# Altium schematic sheet Ethernet_Sheet.SchDoc
size 420 x 297 mm; SheetNumber: 10; SheetTotal: 11
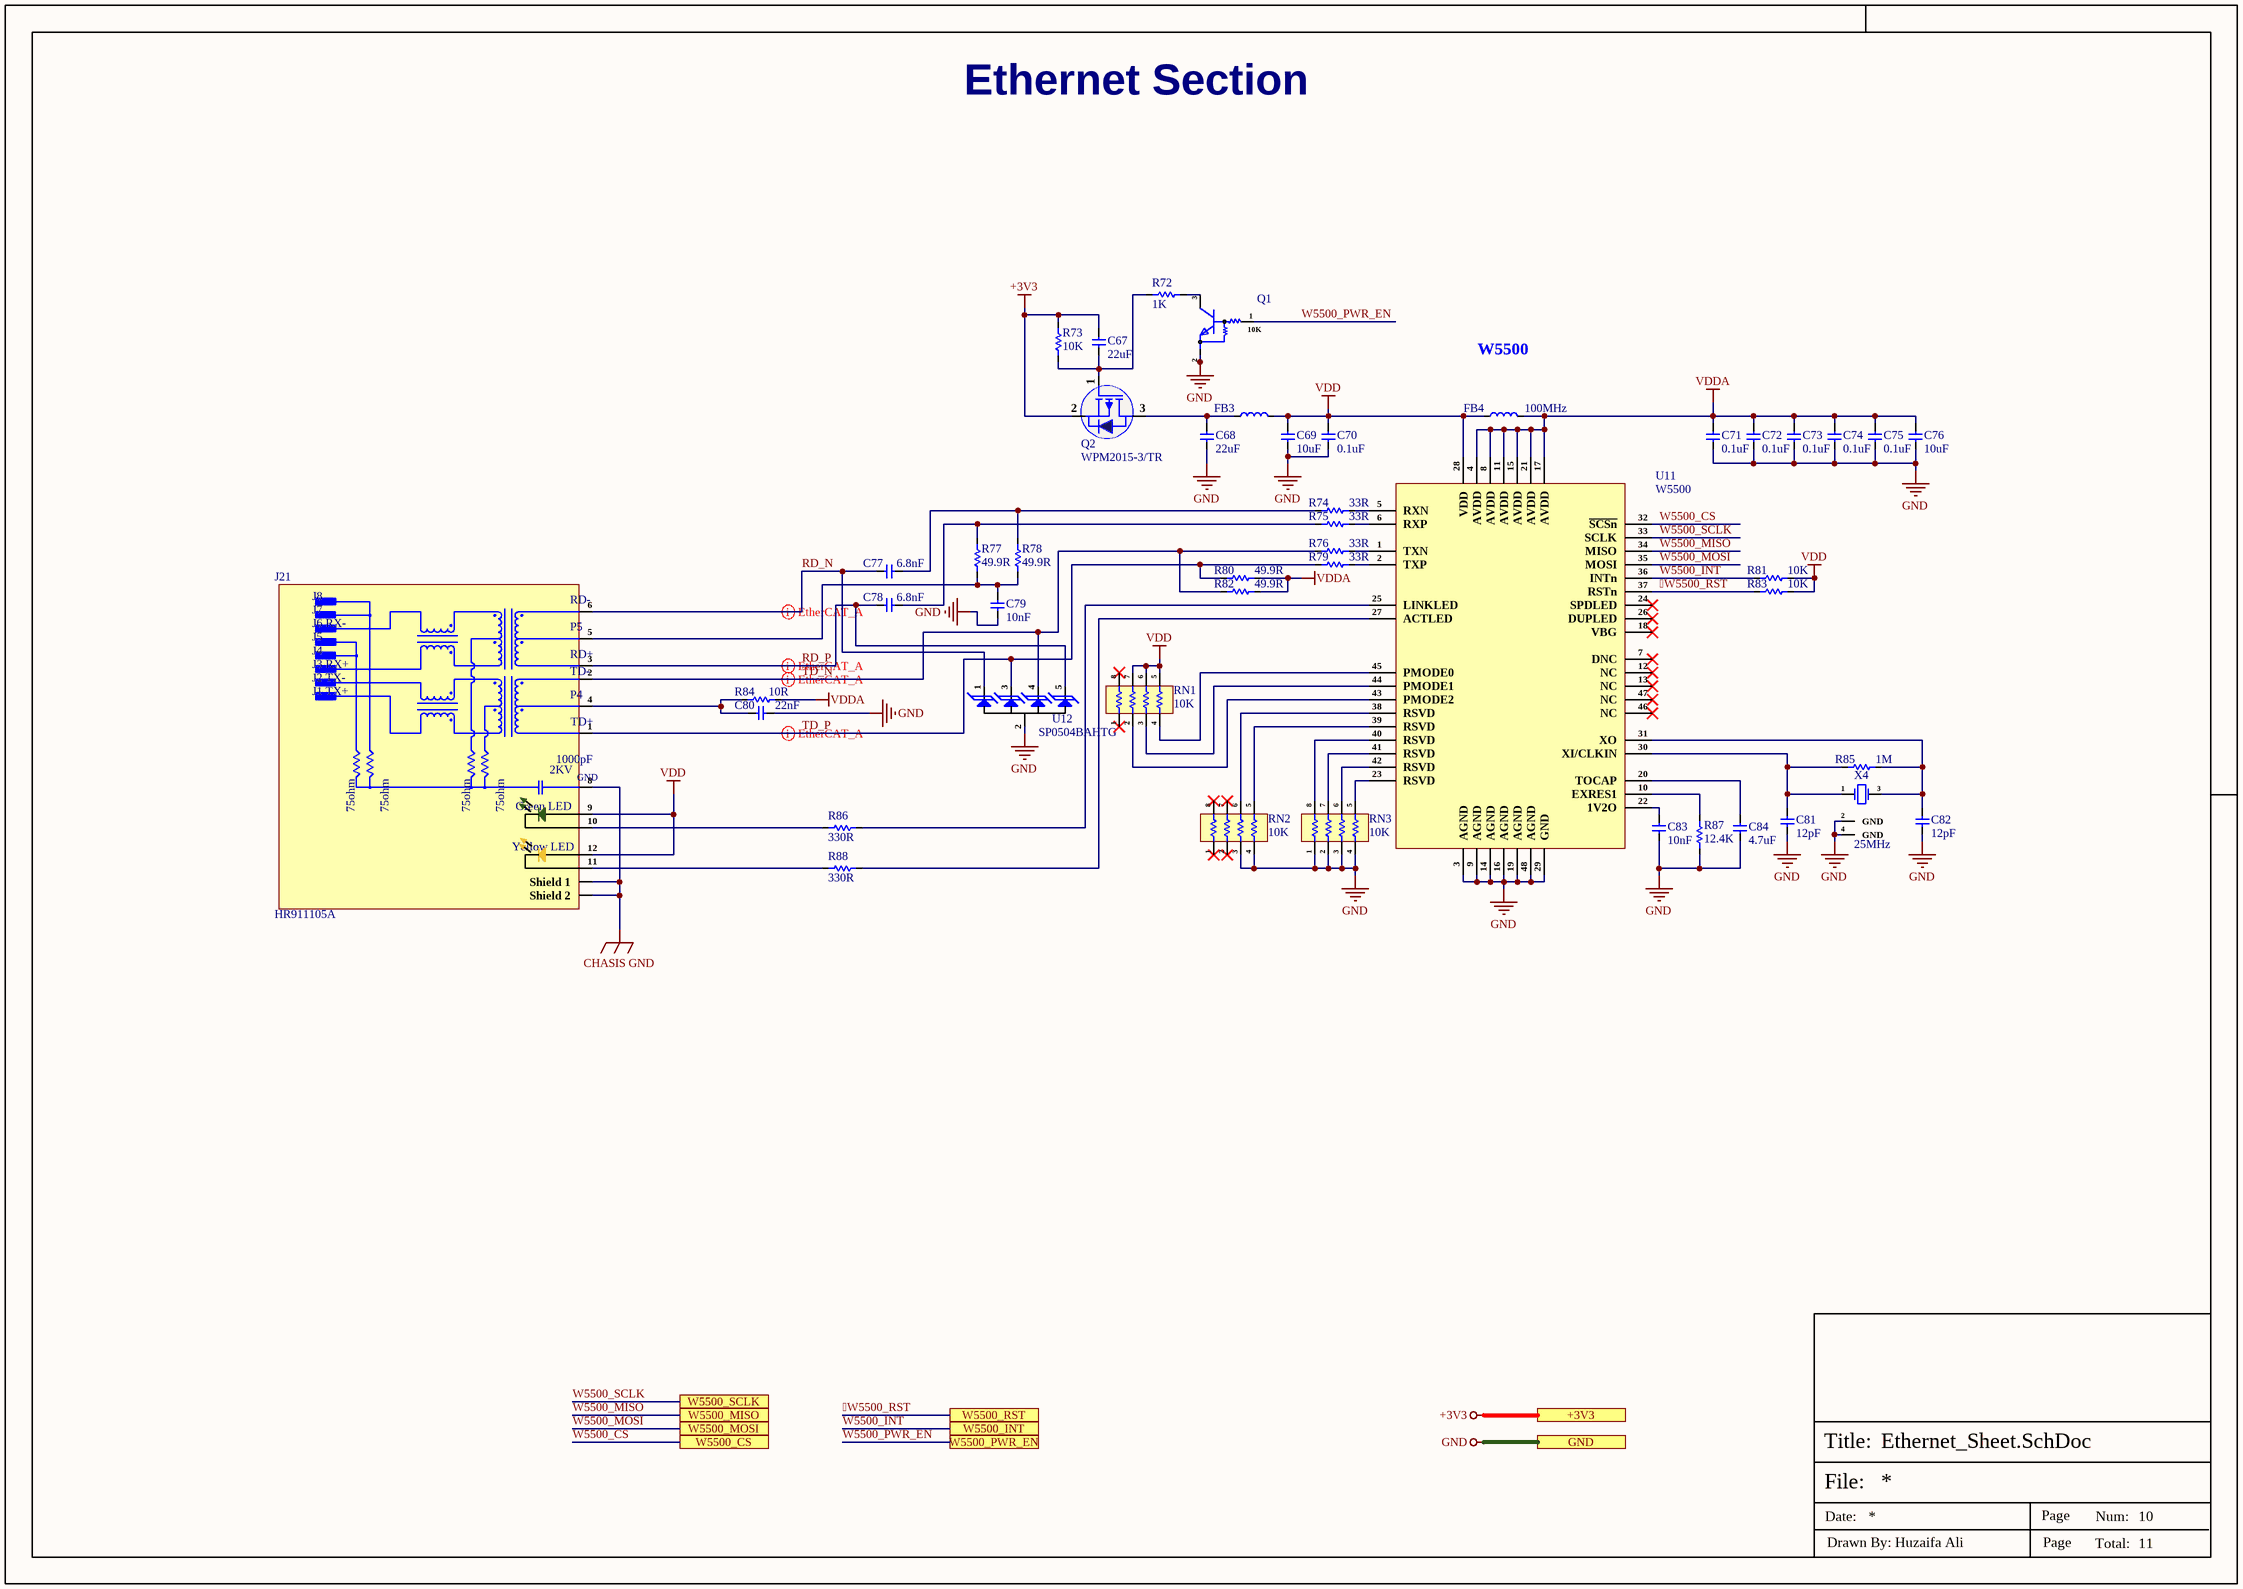
[diagram p0: Ethernet_Sheet.SchDoc]

## Parts
C67  22uF  [Cap-0805]
C68  22uF  [Cap-0805]
C69  10uF  [Cap-0603]
C70  0.1uF  [Cap-0402]
C71  0.1uF  [Cap-0402]
C72  0.1uF  [Cap-0402]
C73  0.1uF  [Cap-0402]
C74  0.1uF  [Cap-0402]
C75  0.1uF  [Cap-0402]
C76  10uF  [Cap-0603]
C77  6.8nF  [Cap-0603]
C78  6.8nF  [Cap-0603]
C79  10nF  [Cap-0603]
C80  22nF  [Cap-0603]
C81  12pF  [Cap-0603]
C82  12pF  [Cap-0603]
C83  10nF  [Cap-0603]
C84  4.7uF  [Cap-0603]
FB3  100MHz  [Ind-0805]  (value not drawn)
FB4  100MHz  [Ind-0805]
J21  HR911105A  [HR911105A]
Q1  LMUN2211LT1G  [SOT-23]  (value not drawn)
Q2  WPM2015-3/TR  [Sot-23]
R72  1K  [Res-0402]
R73  10K  [Res-0402]
R74  33R  [Res-0402]
R75  33R  [Res-0402]
R76  33R  [Res-0402]
R77  49.9R  [Res-0603]
R78  49.9R  [Res-0603]
R79  33R  [Res-0402]
R80  49.9R  [Res-0603]
R81  10K  [Res-0402]
R82  49.9R  [Res-0603]
R83  10K  [Res-0402]
R84  10R  [Res-0402]
R85  1M  [Res-0402]
R86  330R  [Res-0402]
R87  12.4K  [Res-0603]
R88  330R  [Res-0402]
RN1  10K  [YC164-FR-0710KL]
RN2  10K  [YC164-FR-0710KL]
RN3  10K  [YC164-FR-0710KL]
U11  W5500  [48-LQFP (7x7)_]
U12  SP0504BAHTG  [SOT-23-5]
X4  25MHz  [Q22FA12800090]

## Ports
+3V3 (see Top_Sheet[5A], CAN_Sheet[5D], Connector_Sheet[5D], ESP32_Sheet[5D], EtherCAT_Sheet[5D], Power_Sheet[5D], RJ45_Sheet[5D], RS485_RS232_Sheet[5D], STM32_Sheet[5D], TFT_Display_Sheet[5D]), GND (see Top_Sheet[5A], CAN_Sheet[5D], Connector_Sheet[5D], ESP32_Sheet[5D], EtherCAT_Sheet[5D], Power_Sheet[5D], RJ45_Sheet[5D], RS485_RS232_Sheet[5D], STM32_Sheet[5D], TFT_Display_Sheet[5D]), W5500_CS (see Top_Sheet[5A], ESP32_Sheet[2D]), W5500_INT (see Top_Sheet[5A], ESP32_Sheet[2D]), W5500_MISO (see Top_Sheet[5A], ESP32_Sheet[2D]), W5500_MOSI (see Top_Sheet[5A], ESP32_Sheet[2D]), W5500_PWR_EN (see Top_Sheet[5B], ESP32_Sheet[2D]), W5500_RST (see Top_Sheet[5A], ESP32_Sheet[2D]), W5500_SCLK (see Top_Sheet[5A], ESP32_Sheet[2D])

## Nets
+3V3: C67.2 Q2.2(S) R73.2 ; port +3V3
CHASIS GND: J21.8(GND) J21.Shield_1 J21.Shield_2
GND: C68.1 C69.1 C70.1 C71.1 C72.1 C73.1 C74.1 C75.1 C76.1 C79.1 C80.2 C81.1 C82.1 C83.1 C84.1 Q1.2(E) R87.1 RN2.3 RN2.4 RN3.1 RN3.2 RN3.3 RN3.4 U11.3(AGND) U11.9(AGND) U11.14(AGND) U11.16(AGND) U11.19(AGND) U11.29(GND) U11.48(AGND) U12.2(A) X4.2(GND) X4.4(GND) ; port GND
VDD: C69.2 C70.2 FB3.2 FB4.1 J21.9(ANODE) J21.12(ANODE) R81.1 R83.1 RN1.5 RN1.6 RN1.7 U11.28(VDD)
VDDA: C71.2 C72.2 C73.2 C74.2 C75.2 C76.2 FB4.2 R80.1 R82.1 R84.2 U11.4(AVDD) U11.8(AVDD) U11.11(AVDD) U11.15(AVDD) U11.17(AVDD) U11.21(AVDD)
W5500_RST: R83.2 U11.37(RSTn) ; port W5500_RST
RD_N: C77.1 J21.6(RD-) U12.1(K)
RD_P: C78.1 J21.3(RD+) U12.5(K)
TD_N: J21.2(TD-) R76.1 R82.2 U12.4(K)
TD_P: J21.1(TD+) R79.1 R80.2 U12.3(K)
W5500_CS: U11.32(~{SCSn}) ; port W5500_CS
W5500_INT: R81.2 U11.36(INTn) ; port W5500_INT
W5500_MISO: U11.34(MISO) ; port W5500_MISO
W5500_MOSI: U11.35(MOSI) ; port W5500_MOSI
W5500_PWR_EN: Q1.1(B) ; port W5500_PWR_EN
W5500_SCLK: U11.33(SCLK) ; port W5500_SCLK
NetC67_1: C67.1 Q2.1(G) R72.1 R73.1
NetC68_2: C68.2 FB3.1 Q2.3(D)
NetC77_2: C77.2 R74.1 R78.2
NetC78_2: C78.2 R75.1 R77.2
NetC79_2: C79.2 J21.5(P5) R77.1 R78.1
NetC80_1: C80.1 J21.4(P4) R84.1
NetC81_2: C81.2 R85.1 U11.30(XI/CLKIN) X4.1(OSC1)
NetC82_2: C82.2 R85.2 U11.31(XO) X4.3(OSC2)
NetC83_2: C83.2 U11.22(1V2O)
NetC84_2: C84.2 U11.20(TOCAP)
NetJ21_10: J21.10(CATHODE) R86.1
NetJ21_11: J21.11(CATHODE) R88.1
NetQ1_3: Q1.3(C) R72.2
NetR74_2: R74.2 U11.5(RXN)
NetR75_2: R75.2 U11.6(RXP)
NetR76_2: R76.2 U11.1(TXN)
NetR79_2: R79.2 U11.2(TXP)
NetR86_2: R86.2 U11.25(LINKLED)
NetR87_2: R87.2 U11.10(EXRES1)
NetR88_2: R88.2 U11.27(ACTLED)
NetRN1_2: RN1.2 U11.43(PMODE2)
NetRN1_3: RN1.3 U11.44(PMODE1)
NetRN1_4: RN1.4 U11.45(PMODE0)
NetRN2_5: RN2.5 U11.39(RSVD)
NetRN2_6: RN2.6 U11.38(RSVD)
NetRN3_5: RN3.5 U11.23(RSVD)
NetRN3_6: RN3.6 U11.42(RSVD)
NetRN3_7: RN3.7 U11.41(RSVD)
NetRN3_8: RN3.8 U11.40(RSVD)

Not connected (* = marked no-connect by the designer): RN1 1* 8*; RN2 1* 2* 7* 8*; U11 7(DNC)* 12(NC)* 13(NC)* 18(VBG)* 24(SPDLED)* 26(DUPLED)* 46(NC)* 47(NC)*

## Layout directives
differential pair; differential pair class Ethernet_Lines; net class Ethernet; rule Matched Net Lengths [Tolerance = 20mil]; rule Impedance Constraint [Min = 97.00    Max = 105.0    ]: RD_N, RD_P, TD_N, TD_P

## Notes on the sheet
- Ethernet Section
- W5500
- File:
- Title:
- Date:
- Page
- Num:
- Total:
- Drawn By: Huzaifa Ali
- (in symbol HR911105A) J8; J7; J6 RX-; J5; J4; J3 RX+; J2 TX-; J1 TX+; 1000pF; 75ohm; 2KV; Green LED; Yellow LED
- (in symbol LMUN2211LT1G) 10K

## Library data of the parts
C67 = C2012X5R1V226MT000E: CAP CER 22UF 35V X5R 0805; Manufacturer: TDK Corporation; Item Type: Capacitor; Manufacturer Part Number: C2012X5R1V226MT000E; Package: 0805; ComponentLink1Description: LCSC; ComponentLink1URL: https://www.lcsc.com/product-detail/Multilayer-Ceramic-Capacitors-MLCC-SMD-SMT_TDK-C2012X5R1V226M125AC_C2179409.html; LCSC Part Number: C338080
C68 = CC0805MKX5R8BB226: CAP CER 22UF 25V X5R 0805; Manufacturer: Yageo; Tolerance: 20%; Item Type: Capacitor; Supplier 1: Digi-Key; Manufacturer Part Number: CC0805MKX5R8BB226; RoHS: Yes; Category: Ceramic Capacitors; Stock 1: 64970; Pricing 1: 1=0.47000, 10=0.33300, 50=0.25140, 100=0.21900, 500=0.16222, 1000=0.13789 (USD); Mount: Surface Mount; Case/Package: 0805; Case Code (Metric): 2012; Case Code (Imperial): 0805; Weight: 0.000194oz; Min Operating Temperature: -55°C; Max Operating Temperature: 85°C; Packaging: Tape and Reel; Capacitance: 22uF; Voltage Rating: 25V; Dielectric: X5R; Termination: SMD/SMT; Voltage Rating (DC): 25V; Package Quantity: 3000; Length: 0.079inch; Width: 0.049inch; Height: 1.25mm; Thickness: 0.057inch; Lead Free: Lead Free; Halogen Free: Halogen Free; RoHS Compliant: Yes; ComponentLink1URL: http://www.mouser.com/ds/2/447/Yageo_UPY-GP_NP0_16V-to-50V_9-358835.pdf?src-supplier=Mouser; ComponentLink1Description: http://www.mouser.com/ds/2/447/Yageo_UPY-GP_NP0_16V-to-50V_9-358835.pdf?src-supplier=Mouser; ComponentLink2URL: http://www.yageo.com/documents/recent/UPY-GPHC_X5R_4V-to-50V_25.pdf?src-supplier=Digi-Key; ComponentLink2Description: http://www.yageo.com/documents/recent/UPY-GPHC_X5R_4V-to-50V_25.pdf?src-supplier=Digi-Key; Supplier Part Number 1: 311-1903-1-ND; LCSC Part Number: C784585
C69 C76 = CC0603KRX5R7BB106: CAP CER 10UF 16V X5R 0603; Manufacturer: Yageo; Tolerance: 10%; Item Type: Capacitor; Supplier 1: Digi-Key; Manufacturer Part Number: CC0603KRX5R7BB106; RoHS: Yes; Category: Ceramic Capacitors; Stock 1: 240725; Pricing 1: 1=0.68000, 10=0.48000, 50=0.36300, 100=0.31610, 500=0.23416, 1000=0.19903 (USD); Mount: Surface Mount; Case/Package: 0603; Case Code (Imperial): 0603; Case Code (Metric): 1608; Min Operating Temperature: -55°C; Max Operating Temperature: 85°C; Packaging: Cut Tape; Capacitance: 10uF; Voltage Rating: 16V; RoHS Compliant: Yes; ComponentLink1URL: http://www.yageo.com/documents/recent/UPY-GPHC_X5R_4V-to-50V_25.pdf?src-supplier=Digi-Key; ComponentLink1Description: http://www.yageo.com/documents/recent/UPY-GPHC_X5R_4V-to-50V_25.pdf?src-supplier=Digi-Key; Supplier Part Number 1: 311-3486-1-ND; LCSC Part Number: C2936601
C70-C75 = C1005X5R1H104K050BB: CAP CER 0.1UF 50V X5R 0402; Manufacturer: TDK; Dielectric Material: Ceramic; Capacitance: 100nF; Tolerance: 10%; Item Type: Capacitor; Supplier 1: Digi-Key; Manufacturer Part Number: C1005X5R1H104K050BB; Stock 1: 1455182; Pricing 1: 1=0.12, 10=0.09, 50=0.049, 100=0.04, 500=0.02858, 1000=0.02245, 2500=0.02041, 5000=0.01878 (USD); Mount: Surface Mount; Case/Package: 0402; Case Code (Metric): 1005; Case Code (Imperial): 0402; Weight: 2.3E-05oz; Min Operating Temperature: -55°C; Max Operating Temperature: 85°C; Dielectric: X5R; Voltage Rating: 50V; Packaging: Tape and Reel; Voltage Rating (DC): 50V; Termination: SMD/SMT; Construction: Flat; Package Quantity: 1; Resistor Type: Ceramic; Voltage: 50V; Series: C; Length: 1mm; Width: 0.02inch; Height: 0.5mm; Depth: 0.5mm; Thickness: 0.022inch; Radiation Hardening: No; Lead Free: Lead Free; REACH SVHC: No SVHC; RoHS Compliant: Yes; ComponentLink1URL: https://product.tdk.com/info/en/catalog/spec/mlccspec_commercial_general_midvoltage_en.pdf?src-supplier=Digi-Key; ComponentLink1Description: https://product.tdk.com/info/en/catalog/spec/mlccspec_commercial_general_midvoltage_en.pdf?src-supplier=Digi-Key; ComponentLink2URL: http://www.tdk.co.jp/tefe02/e413_c.pdf?src-supplier=Future+Electronics; ComponentLink2Description: http://www.tdk.co.jp/tefe02/e413_c.pdf?src-supplier=Future+Electronics; ComponentLink3URL: https://www.verical.com/server-webapp/html/getDatasheet?partID=743571&src-supplier=Verical; ComponentLink3Description: https://www.verical.com/server-webapp/html/getDatasheet?partID=743571&src-supplier=Verical; ComponentLink4URL: http://www.tdk.co.jp/tefe02/e412_c.pdf?src-supplier=Avnet+Europe; ComponentLink4Description: http://www.tdk.co.jp/tefe02/e412_c.pdf?src-supplier=Avnet+Europe; Supplier Part Number 1: 445-5942-1-ND; LCSC Part Number: C2181865
C77 C78 = 0603B682K500NT: 50V 6.8nF X7R ±10% 0603; Manufacturer: FH; Item Type: Capacitor; ComponentLink1Description: LCSC; ComponentLink1URL: https://www.lcsc.com/product-detail/Multilayer-Ceramic-Capacitors-MLCC-SMD-SMT_FH-Guangdong-Fenghua-Advanced-Tech-0603B682K500NT_C1631.html; Manufacturer Part Number: 0603B682K500NT; Footprint: 0603; Value: 6.8nF; LCSC Part Number: C1631
C79 C83 = CC0603JRNPO9BN103: CAP CER 10000PF 50V C0G/NPO 0603; Manufacturer: Yageo; Tolerance: 5%; Item Type: Capacitor; Supplier 1: Arrow Electronics; Manufacturer Part Number: CC0603JRNPO9BN103; RoHS: Yes; Category: Ceramic Capacitors; Stock 1: 5425; Pricing 1: 1=0.42340, 10=0.29770, 25=0.25590, 100=0.19550, 250=0.19360, 500=0.14320, 1000=0.12060, 3000=0.11930 (USD); Mount: Surface Mount; Case/Package: 0603; Min Operating Temperature: -55°C; Max Operating Temperature: 125°C; Packaging: Tape and Reel; Capacitance: 10nF; Voltage Rating: 50V; Length: 0.063inch; Width: 0.031inch; Thickness: 0.035inch; RoHS Compliant: Yes; ComponentLink1URL: http://www.yageo.com/documents/recent/UPY-GP_NP0_16V-to-50V_16.pdf?src-supplier=Digi-Key; ComponentLink1Description: http://www.yageo.com/documents/recent/UPY-GP_NP0_16V-to-50V_16.pdf?src-supplier=Digi-Key; ComponentLink2URL: http://www.yageo.com/exep/pages/download/literatures/ProductSelectionGuide%202014_Final_2.pdf?src-supplier=Digi-Key; ComponentLink2Description: http://www.yageo.com/exep/pages/download/literatures/ProductSelectionGuide%202014_Final_2.pdf?src-supplier=Digi-Key; Supplier Part Number 1: CC0603JRNPO9BN103; LCSC Part Number: C389113
C80 = CC0603KRX7R9BB223: CAP CER 0.022UF 50V X7R 0603; Manufacturer: Yageo; Dielectric Material: Ceramic; Tolerance: 10%; Insulation Resistance: 100GR; Item Type: Capacitor; Supplier 1: Digi-Key; Manufacturer Part Number: CC0603KRX7R9BB223; RoHS: Yes; Category: Ceramic Capacitors; Stock 1: 119735; Pricing 1: 1=0.10000, 10=0.05500, 50=0.03020, 100=0.02460, 500=0.01760, 1000=0.01383 (USD); Mount: Surface Mount; Case/Package: 0603; Number of Pins: 2; Case Code (Metric): 1608; Case Code (Imperial): 0603; Min Operating Temperature: -55°C; Max Operating Temperature: 125°C; Capacitance: 22nF; Dielectric: X7R; Voltage: 50V; Package Quantity: 1; Voltage Rating: 50V; Packaging: Tape and Reel; Voltage Rating (DC): 50V; Termination: SMD/SMT; Resistor Type: Ceramic; Series: CC; Length: 1.6mm; Width: 0.031inch; Height: 0.8mm; Depth: 0.8mm; Thickness: 0.035inch; Radiation Hardening: No; RoHS Compliant: Yes; REACH SVHC: No SVHC; Lead Free: Lead Free; Halogen Free: Halogen Free; ComponentLink1URL: https://datasheet.ciiva.com/8033/70765-8033869.pdf?src-supplier=Element14; ComponentLink1Description: https://datasheet.ciiva.com/8033/70765-8033869.pdf?src-supplier=Element14; ComponentLink2URL: https://datasheet.ciiva.com/28450/1489800-28450639.pdf?src-supplier=Element14; ComponentLink2Description: https://datasheet.ciiva.com/28450/1489800-28450639.pdf?src-supplier=Element14; ComponentLink3URL: https://datasheet.ciiva.com/8033/1489800-8033867.pdf?src-supplier=Element14; ComponentLink3Description: https://datasheet.ciiva.com/8033/1489800-8033867.pdf?src-supplier=Element14; ComponentLink4URL: https://datasheet.ciiva.com/8033/1489800-8033865.pdf?src-supplier=Element14; ComponentLink4Description: https://datasheet.ciiva.com/8033/1489800-8033865.pdf?src-supplier=Element14; ComponentLink5URL: https://datasheet.ciiva.com/156/mlccorderingcode-156178.pdf?src-supplier=Digi-Key; ComponentLink5Description: https://datasheet.ciiva.com/156/mlccorderingcode-156178.pdf?src-supplier=Digi-Key; ComponentLink6URL: https://datasheet.ciiva.com/156/mlccorderingcode-156177.pdf?src-supplier=Digi-Key; ComponentLink6Description: https://datasheet.ciiva.com/156/mlccorderingcode-156177.pdf?src-supplier=Digi-Key; ComponentLink7URL: https://datasheet.ciiva.com/156/mlccorderingcode-156179.pdf?src-supplier=Digi-Key; ComponentLink7Description: https://datasheet.ciiva.com/156/mlccorderingcode-156179.pdf?src-supplier=Digi-Key; ComponentLink8URL: https://datasheet.ciiva.com/11464/upy-gphc-x7r-6-3v-to-50v-8-11464741.pdf?src-supplier=Avnet; ComponentLink8Description: https://datasheet.ciiva.com/11464/upy-gphc-x7r-6-3v-to-50v-8-11464741.pdf?src-supplier=Avnet; Supplier Part Number 1: 311-1370-1-ND; LCSC Part Number: C106222
C81 C82 = CC0603JRNPO9BN120: CAP CER 12PF 50V C0G/NPO 0603; Manufacturer: Yageo; Manufacturer Part Number: CC0603J*NPO9B*120; Dielectric Material: Ceramic; Tolerance: 5%; Dielectric: C0G; Insulation Resistance: 100GR; Item Type: Capacitor; ComponentLink1URL: http://www.kemet.com/kemet/web/homepage/kechome.nsf/file/F9080B_0402_Series_C0G/$file/F9080B_0402_Series_C0G.pdf?src-supplier=Element14; ComponentLink1Description: http://www.kemet.com/kemet/web/homepage/kechome.nsf/file/F9080B_0402_Series_C0G/$file/F9080B_0402_Series_C0G.pdf?src-supplier=Element14; ComponentLink2URL: http://www.farnell.com/datasheets/1372242.pdf?src-supplier=Element14; ComponentLink2Description: http://www.farnell.com/datasheets/1372242.pdf?src-supplier=Element14; Supplier 1: Digi-Key; Stock 1: 141041; Pricing 1: 1=0.1, 10=0.065, 100=0.0288, 500=0.0206, 1000=0.0162 (USD); Number of Pins: 2; Capacitance: 12pF; Packaging: Cut Tape; Voltage Rating (DC): 50V; REACH SVHC: No SVHC; Lead Free: Lead Free; Supplier Part Number 1: 311-1059-1-ND; LCSC Part Number: C107034
C84 = CC0603KRX5R6BB475: CAP CER 4.7UF 10V X5R 0603; Manufacturer: Yageo; Tolerance: 10%; Item Type: Capacitor; Supplier 1: Mouser; Manufacturer Part Number: CC0603KRX5R6BB475; RoHS: Yes; Category: Ceramic Capacitors; Stock 1: 479165; Pricing 1: 1=0.27000, 10=0.11200, 50=0.11200, 100=0.09500, 500=0.06500, 1000=0.05800, 2000=0.05600, 4000=0.04700, 8000=0.04000, 10000=0.04000 (USD); Mount: Surface Mount; Case/Package: 0603; Case Code (Imperial): 0603; Case Code (Metric): 1608; Min Operating Temperature: -55°C; Max Operating Temperature: 85°C; Capacitance: 4.7uF; Dielectric: X5R; Voltage Rating: 10V; Voltage Rating (DC): 10V; Packaging: Tape and Reel; Package Quantity: 1; Termination: SMD/SMT; Resistor Type: Ceramic; Series: CC; Construction: Flat; Length: 1.6mm; Width: 0.8mm; Height: 0.8mm; Thickness: 0.035inch; Depth: 0.8mm; Radiation Hardening: No; REACH SVHC: Unknown; Lead Free: Lead Free; Halogen Free: Halogen Free; RoHS Compliant: Yes; ComponentLink1URL: https://datasheet.ciiva.com/8033/1525783-8033802.pdf?src-supplier=Element14; ComponentLink1Description: https://datasheet.ciiva.com/8033/1525783-8033802.pdf?src-supplier=Element14; ComponentLink2URL: https://datasheet.ciiva.com/8033/1525783-8033798.pdf?src-supplier=Element14; ComponentLink2Description: https://datasheet.ciiva.com/8033/1525783-8033798.pdf?src-supplier=Element14; ComponentLink3URL: https://datasheet.ciiva.com/179/mlccorderingcode-179705.pdf?src-supplier=Digi-Key; ComponentLink3Description: https://datasheet.ciiva.com/179/mlccorderingcode-179705.pdf?src-supplier=Digi-Key; ComponentLink4URL: https://datasheet.ciiva.com/179/mlccorderingcode-179704.pdf?src-supplier=Digi-Key; ComponentLink4Description: https://datasheet.ciiva.com/179/mlccorderingcode-179704.pdf?src-supplier=Digi-Key; ComponentLink5URL: https://datasheet.ciiva.com/179/mlccorderingcode-179706.pdf?src-supplier=Digi-Key; ComponentLink5Description: https://datasheet.ciiva.com/179/mlccorderingcode-179706.pdf?src-supplier=Digi-Key; ComponentLink6URL: https://datasheet.ciiva.com/11586/upy-gphc-x5r-4v-to-50v-12-11586314.pdf?src-supplier=Avnet; ComponentLink6Description: https://datasheet.ciiva.com/11586/upy-gphc-x5r-4v-to-50v-12-11586314.pdf?src-supplier=Avnet; Supplier Part Number 1: 603-CC603KRX5R6BB475; LCSC Part Number: C109456
FB3 FB4 = YI201209U301-2R0T: 100mΩ ±25% 300Ω@100MHz 0805 Ferrite Beads ROHS; Manufacturer: YJYCOIN; Manufacturer Part Number: YI201209U301-2R0T; Package: 0805; LCSC Part Number: C2858467; Item Type: Ferrite Bead; ComponentLink1Description: LCSC; ComponentLink1URL: https://www.lcsc.com/product-detail/span-style-background-color-ff0-Ferrite-span-Beads_YJYCOIN-YI201209U301-2R0T_C2858467.html
J21 = HR911105A: RJ45 RJReceptacle 1 WithLED Plugin Ethernet Connectors/Modular Connectors (RJ45 RJ11) ROHS; Manufacturer: HANRUN; Item Type: RJ45 Connector; Manufacturer Part Number: HR911105A; Package: Plugin; LCSC Part Number: C12074; ComponentLink1Description: LCSC; ComponentLink1URL: https://www.lcsc.com/product-detail/Ethernet-Connectors-Modular-Connectors-RJ45-RJ11_HANRUN-Zhongshan-HanRun-Elec-HR911105A_C12074.html
Q1 = LMUN2211LT1G: NPN 246mW 100mA 50V SOT-23 Digital Transistors ROHS; Manufacturer: LRC; Item Type: Mosfet; Manufacturer Part Number: LMUN2211LT1G; Package: SOT-23; LCSC Part Number: C12775; ComponentLink1Description: LCSC; ComponentLink1URL: https://www.lcsc.com/product-detail/Digital-Transistors_LRC-LMUN2211LT1G_C12775.html
Q2 = WPM2015-3/TR: 20V 2.2A 800mW 110mΩ@4.5V,2.7A 810mV@250uA P Channel SOT-23 MOSFETs ROHS; Manufacturer: WILLSEMI; Item Type: Mosfet; Manufacturer Part Number: WPM2015-3/TR; Package: SOT-23; LCSC Part Number: C213159; ComponentLink1Description: LCSC; ComponentLink1URL: https://www.lcsc.com/product-detail/MOSFETs_WILLSEMI-Will-Semicon-WPM2015-3-TR_C213159.html
R72 = CRCW04021K00FKEDHP: RES SMD 1K OHM 1% 1/5W 0402; Manufacturer: Vishay Dale; Resistance: 1kR; Temperature Coefficient: 100ppm/°C; Power Rating: 125mW; Voltage Rating: 50V; Supplier 1: Digi-Key; Manufacturer Part Number: CRCW04021K00FKEDHP; Stock 1: 315989; Pricing 1: 1=0.15, 10=0.132, 100=0.0506, 1000=0.02226, 2500=0.01923, 5000=0.0172 (USD); Mount: Surface Mount; Case/Package: 0402; Number of Pins: 2; Contact Plating: Tin; Weight: 2.3E-05oz; Case Code (Imperial): 0402; Case Code (Metric): 1005; Size Code: 0402; Min Operating Temperature: -55°C; Max Operating Temperature: 155°C; Tolerance: 1%; Resistor Type: Thick Film; Package Quantity: 10; Packaging: Tape and Reel; Number of Terminations: 2; Termination: SMD/SMT; Max Power Dissipation: 125mW; Voltage Rating (DC): 50V; Features: Automotive AEC-Q200; Series: CRCW-HP; Construction: Rectangular; Technology: THICK FILM; Resistance Tolerance: 1%; Length: 1mm; Width: 0.5mm; Height: 0.3mm; Depth: 0.5mm; Radiation Hardening: No; REACH SVHC: Unknown; Military Standard: Not; Lead Free: Lead Free; RoHS Compliant: Yes; ComponentLink1URL: http://www.farnell.com/datasheets/2339608.pdf?src-supplier=Element14; ComponentLink1Description: http://www.farnell.com/datasheets/2339608.pdf?src-supplier=Element14; ComponentLink2URL: http://www.vishay.com/docs/20043/crcwhpe3.pdf?src-supplier=Digi-Key; ComponentLink2Description: http://www.vishay.com/docs/20043/crcwhpe3.pdf?src-supplier=Digi-Key; ComponentLink3URL: http://www.mouser.com/ds/2/427/crcwhpe3-46056.pdf?src-supplier=Mouser; ComponentLink3Description: http://www.mouser.com/ds/2/427/crcwhpe3-46056.pdf?src-supplier=Mouser; ComponentLink4URL: http://www.vishay.com/docs/20043/crcwhpe3.pdf?src-supplier=Avnet; ComponentLink4Description: http://www.vishay.com/docs/20043/crcwhpe3.pdf?src-supplier=Avnet; ComponentLink5URL: http://www.vishay.com/docs/20043/crcwhpe3.pdf?src-supplier=Future+Electronics; ComponentLink5Description: http://www.vishay.com/docs/20043/crcwhpe3.pdf?src-supplier=Future+Electronics; Supplier Part Number 1: 541-1.00KYCT-ND; LCSC Part Number: C313354
R73 R81 R83 = RC0402FR-0710KL: RES 10K OHM 1% 1/16W 0402; Manufacturer: Yageo; Resistance: 10kR; Voltage Rating (DC): 50V; Temperature Coefficient: 100ppm/°C; Power Rating: 62.5mW; Max Power Dissipation: 63mW; Item Type: Resistor; Supplier 1: Mouser; Manufacturer Part Number: RC0402FR-0710KL; RoHS: Yes; Category: Chip SMD Resistors; Stock 1: 18648329; Pricing 1: 1=0.10000, 10=0.01400, 50=0.01400, 100=0.00500, 1000=0.00300, 10000=0.00200 (USD); Case/Package: 0402; Number of Pins: 2; Case Code (Imperial): 0402; Case Code (Metric): 1005; Min Operating Temperature: -55°C; Max Operating Temperature: 155°C; Resistor Type: Thick Film; Tolerance: 1%; Packaging: Tape and Reel; Voltage Rating: 50V; Termination: SMD/SMT; Working Voltage: 50V; Number of Terminations: 2; Features: Moisture Resistant; Series: RC; Resistance Tolerance: 1%; Construction: Rectangular; Length: 1mm; Width: 0.5mm; Height: 0.32mm; Depth: 0.5mm; Lead Pitch: 0.2mm; REACH SVHC: No SVHC; Lead Free: Lead Free; RoHS Compliant: Yes; Military Standard: Not; ComponentLink1URL: https://datasheet.ciiva.com/7660/38568-7660787.pdf?src-supplier=Element14; ComponentLink1Description: https://datasheet.ciiva.com/7660/38568-7660787.pdf?src-supplier=Element14; ComponentLink2URL: https://datasheet.ciiva.com/7849/1686128-7849814.pdf?src-supplier=Element14; ComponentLink2Description: https://datasheet.ciiva.com/7849/1686128-7849814.pdf?src-supplier=Element14; ComponentLink3URL: https://datasheet.ciiva.com/7983/1018594-7983486.pdf?src-supplier=Element14; ComponentLink3Description: https://datasheet.ciiva.com/7983/1018594-7983486.pdf?src-supplier=Element14; ComponentLink4URL: https://datasheet.ciiva.com/22747/1018594-22747512.pdf?src-supplier=Element14; ComponentLink4Description: https://datasheet.ciiva.com/22747/1018594-22747512.pdf?src-supplier=Element14; ComponentLink5URL: https://datasheet.ciiva.com/12667/pyu-rc0402-51-rohs-l-6-r-12667067.pdf?src-supplier=Mouser; ComponentLink5Description: https://datasheet.ciiva.com/12667/pyu-rc0402-51-rohs-l-6-r-12667067.pdf?src-supplier=Mouser; ComponentLink6URL: https://datasheet.ciiva.com/7849/1784430-7849813.pdf?src-supplier=Element14; ComponentLink6Description: https://datasheet.ciiva.com/7849/1784430-7849813.pdf?src-supplier=Element14; ComponentLink7URL: https://datasheet.ciiva.com/7849/1784430-7849815.pdf?src-supplier=Element14; ComponentLink7Description: https://datasheet.ciiva.com/7849/1784430-7849815.pdf?src-supplier=Element14; Supplier Part Number 1: 603-RC0402FR-0710KL; LCSC Part Number: C60490
R74-R76 R79 = RC0402FR-0733RL: RES 33 OHM 1% 1/16W 0402; Manufacturer: Yageo; Power Rating: 62.5mW; Voltage Rating: 50V; Temperature Coefficient: 100ppm/°C; Max Power Dissipation: 63mW; Supplier 1: Mouser; Manufacturer Part Number: RC0402FR-0733RL; RoHS: Yes; Category: Chip SMD Resistors; Stock 1: 1843488; Pricing 1: 1=0.10000, 10=0.01200, 50=0.01200, 100=0.00500, 1000=0.00300, 10000=0.00100 (USD); Case/Package: 0402; Number of Pins: 2; Case Code (Imperial): 0402; Case Code (Metric): 1005; Size Code: 0402; Min Operating Temperature: -55°C; Max Operating Temperature: 155°C; Resistor Type: Thick Film; Resistance: 33R; Tolerance: 1%; Packaging: Tape and Reel; Voltage Rating (DC): 50V; Package Quantity: 10000; Termination: SMD/SMT; Features: Moisture Resistant; Series: RC; Number of Terminations: 2; Resistance Tolerance: 1%; Construction: Rectangular; Technology: THICK FILM; Length: 1mm; Width: 0.5mm; Height: 0.35mm; Depth: 0.5mm; RoHS Compliant: Yes; REACH SVHC: Unknown; Military Standard: Not; Lead Free: Lead Free; ComponentLink1URL: https://datasheet.ciiva.com/11819/0900766b80c66297-11819487.pdf?src-supplier=RSComponents; ComponentLink1Description: https://datasheet.ciiva.com/11819/0900766b80c66297-11819487.pdf?src-supplier=RSComponents; ComponentLink2URL: https://datasheet.ciiva.com/24070/pyu-rc0402-51-rohs-l-6-r-8721-24070077.pdf?src-supplier=Mouser; ComponentLink2Description: https://datasheet.ciiva.com/24070/pyu-rc0402-51-rohs-l-6-r-8721-24070077.pdf?src-supplier=Mouser; ComponentLink3URL: https://datasheet.ciiva.com/7849/1018594-7849967.pdf?src-supplier=Element14; ComponentLink3Description: https://datasheet.ciiva.com/7849/1018594-7849967.pdf?src-supplier=Element14; ComponentLink4URL: https://datasheet.ciiva.com/7849/1018594-7849966.pdf?src-supplier=Element14; ComponentLink4Description: https://datasheet.ciiva.com/7849/1018594-7849966.pdf?src-supplier=Element14; ComponentLink5URL: https://datasheet.ciiva.com/15189/getdatasheetpartid-329253-15189431.pdf?src-supplier=Verical; ComponentLink5Description: https://datasheet.ciiva.com/15189/getdatasheetpartid-329253-15189431.pdf?src-supplier=Verical; ComponentLink6URL: https://datasheet.ciiva.com/17070/pyu-rc0402-51-rohs-l-6-r-17070335.pdf?src-supplier=Future+Electronics; ComponentLink6Description: https://datasheet.ciiva.com/17070/pyu-rc0402-51-rohs-l-6-r-17070335.pdf?src-supplier=Future+Electronics; Supplier Part Number 1: 603-RC0402FR-0733RL; LCSC Part Number: C138002
R77 R78 R80 R82 = RC0603FR-0749R9L: RES 49.9 OHM 1% 1/10W 0603; Manufacturer: Yageo; Temperature Coefficient: 100ppm/°C; Voltage Rating (DC): 50V; Power Rating: 100mW; Item Type: Resistor; Supplier 1: Arrow Electronics; Manufacturer Part Number: RC0603FR-0749R9L; RoHS: Yes; Category: Chip SMD Resistors; Stock 1: 2075000; Pricing 1: 5000=0.00280 (USD); Case/Package: 0603; Number of Pins: 2; Case Code (Imperial): 0603; Case Code (Metric): 1608; Size Code: 0603; Min Operating Temperature: -55°C; Max Operating Temperature: 155°C; Tolerance: 1%; Resistance: 49.9R; Resistor Type: Thick Film; Packaging: Tape and Reel; Voltage Rating: 50V; Termination: SMD/SMT; Features: Moisture Resistant; Series: RC; Max Power Dissipation: 100mW; Number of Terminations: 2; Construction: Rectangular; Resistance Tolerance: 1%; Technology: THICK FILM; Length: 1.6mm; Height: 0.45mm; Depth: 0.8mm; Lead Free: Lead Free; REACH SVHC: No SVHC; Military Standard: Not; RoHS Compliant: Yes; ComponentLink1URL: https://datasheet.ciiva.com/11808/0900766b80f96399-11808223.pdf?src-supplier=RSComponents; ComponentLink1Description: https://datasheet.ciiva.com/11808/0900766b80f96399-11808223.pdf?src-supplier=RSComponents; ComponentLink2URL: https://datasheet.ciiva.com/22747/443971-22747527.pdf?src-supplier=Element14; ComponentLink2Description: https://datasheet.ciiva.com/22747/443971-22747527.pdf?src-supplier=Element14; ComponentLink3URL: https://datasheet.ciiva.com/15189/getdatasheetpartid-325421-15189750.pdf?src-supplier=Verical; ComponentLink3Description: https://datasheet.ciiva.com/15189/getdatasheetpartid-325421-15189750.pdf?src-supplier=Verical; Supplier Part Number 1: RC0603FR-0749R9L; LCSC Part Number: C114625
R84 = CRCW040210R0FKEDHP: RES SMD 10 OHM 1% 1/5W 0402; Manufacturer: Vishay Dale; Power Rating: 125mW; Voltage Rating: 50V; Temperature Coefficient: 100ppm/°C; Max Power Dissipation: 200mW; Supplier 1: Digi-Key; Manufacturer Part Number: CRCW040210R0FKEDHP; Stock 1: 28500; Pricing 1: 1=0.15, 10=0.132, 100=0.0506, 1000=0.02226, 2500=0.01923, 5000=0.0172 (USD); Mount: Surface Mount; Case/Package: 0402; Weight: 2.3E-05oz; Case Code (Imperial): 0402; Case Code (Metric): 1005; Contact Plating: Tin; Min Operating Temperature: -55°C; Max Operating Temperature: 155°C; Resistance: 10R; Tolerance: 1%; Packaging: Tape and Reel; Package Quantity: 10000; Termination: SMD/SMT; Resistor Type: Thick Film; Voltage Rating (DC): 50V; Features: Automotive AEC-Q200; Series: CRCW-HP; Number of Terminations: 2; Resistance Tolerance: 1%; Technology: THICK FILM; Construction: Rectangular; Length: 1mm; Width: 0.5mm; Height: 0.3mm; Depth: 0.5mm; Radiation Hardening: No; REACH SVHC: Unknown; Military Standard: Not; Lead Free: Lead Free; RoHS Compliant: Yes; ComponentLink1URL: http://www.mouser.com/ds/2/427/crcwhpe3-46056.pdf?src-supplier=Mouser; ComponentLink1Description: http://www.mouser.com/ds/2/427/crcwhpe3-46056.pdf?src-supplier=Mouser; Supplier Part Number 1: 541-10.0YCT-ND; LCSC Part Number: C4013850
R85 = AF0402JR-071ML: RES SMD 1M OHM 5% 1/16W 0402; Manufacturer: Yageo; Resistance: 1MR; Max Power Dissipation: 63mW; Temperature Coefficient: 100ppm/°C; Item Type: Resistor; Supplier 1: Digi-Key; Manufacturer Part Number: AF0402JR-071ML; Stock 1: 0; Pricing 1: 10000=0.00408 (USD); Case/Package: 0402; Min Operating Temperature: -55°C; Max Operating Temperature: 155°C; Packaging: Tape and Reel; Resistor Type: Thick Film; Number of Terminations: 2; Tolerance: 5%; Features: Moisture Resistant,Anti-Sulfur; Length: 0.039inch; Width: 0.02inch; Height: 0.015inch; RoHS Compliant: Yes; ComponentLink1URL: https://www.yageo.com/upload/media/product/productsearch/datasheet/rchip/PYu-AF_51_RoHS_L_6.pdf?src-supplier=Digi-Key; ComponentLink1Description: https://www.yageo.com/upload/media/product/productsearch/datasheet/rchip/PYu-AF_51_RoHS_L_6.pdf?src-supplier=Digi-Key; Supplier Part Number 1: AF0402JR-071ML-ND; LCSC Part Number: C144054
R86 R88 = CRCW0402330RFKEDC: SMD Chip Resistor, 330 Ohm, ± 1%, 63 mW, 0402 [1005 Metric], Thick Film, General Purpose; Manufacturer: Vishay Semiconductors; Temperature Coefficient: 100ppm/°C; Max Power Dissipation: 63mW; Supplier: Digikey; Supplier Part Number: 541-3996-1-ND; Manufacturer Part Number: CRCW0402330RFKEDC; RoHS: Yes; Category: Chip SMD Resistors; Stock: 59136; Pricing: 1=0.1, 10=0.024, 50=0.0152, 100=0.0127, 500=0.00866, 1000=0.00746, 5000=0.00542 (USD); Case/Package: 0402; Case Code (Imperial): 0402; Case Code (Metric): 1005; Min Operating Temperature: -55°C; Max Operating Temperature: 155°C; Tolerance: 1%; Value: 330R; Series: CRCW-C; Packaging: Tape and Reel; Number of Terminations: 2; Lead Free: Lead Free; RoHS Compliant: Yes; ComponentLink1URL: http://www.vishay.com/docs/28773/crcwce3.pdf?src-supplier=Digikey; ComponentLink1Description: http://www.vishay.com/docs/28773/crcwce3.pdf?src-supplier=Digikey
R87 = RC0603FR-0712K4L: RES SMD 12.4K OHM 1% 1/10W 0603; Manufacturer: Yageo; Resistance: 12.4kR; Power Rating: 100mW; Voltage Rating: 50V; Temperature Coefficient: 100ppm/°C; Working Voltage: 75V; Item Type: Resistor; Supplier 1: Digi-Key; Manufacturer Part Number: RC0603FR-0712K4L; RoHS: Yes; Category: Chip SMD Resistors; Stock 1: 494008; Pricing 1: 1=0.10000, 10=0.02400, 100=0.00970, 1000=0.00436, 2500=0.00378 (USD); Case/Package: 0603; Case Code (Metric): 1608; Case Code (Imperial): 0603; Min Operating Temperature: -55°C; Max Operating Temperature: 155°C; Packaging: Tape and Reel; Tolerance: 1%; Package Quantity: 1; Resistor Type: Thick Film; Number of Terminations: 2; Termination: SMD/SMT; Max Power Dissipation: 100mW; Voltage Rating (DC): 50V; Features: Moisture Resistant; Series: RC; Construction: Rectangular; Technology: THICK FILM; Length: 0.063inch; Width: 0.031inch; Height: 0.022inch; Depth: 0.8mm; Military Standard: Not; Lead Free: Lead Free; RoHS Compliant: Yes; ComponentLink1URL: https://datasheet.ciiva.com/2454/pyu-r-int-thick-7-2454069.pdf?src-supplier=Digi-Key; ComponentLink1Description: https://datasheet.ciiva.com/2454/pyu-r-int-thick-7-2454069.pdf?src-supplier=Digi-Key; ComponentLink2URL: https://datasheet.ciiva.com/2454/pyu-r-int-thick-7-2454070.pdf?src-supplier=Digi-Key; ComponentLink2Description: https://datasheet.ciiva.com/2454/pyu-r-int-thick-7-2454070.pdf?src-supplier=Digi-Key; ComponentLink3URL: https://datasheet.ciiva.com/2454/pyu-r-int-thick-7-2454071.pdf?src-supplier=Digi-Key; ComponentLink3Description: https://datasheet.ciiva.com/2454/pyu-r-int-thick-7-2454071.pdf?src-supplier=Digi-Key; Supplier Part Number 1: 311-12.4KHRCT-ND; LCSC Part Number: C137798
RN1-RN3 = YC164-FR-0710KL: RES ARRAY 4 RES 10K OHM 1206; Manufacturer: Yageo; Tolerance: 1%; Voltage Rating: 50V; Number of Elements: 4; Value: 10kR; Circuit Type: Isolated; Power Per Element: 62.5mW; Temperature Coefficient: 200ppm/°C; Item Type: Resistor Array; Supplier 1: Future Electronics; Manufacturer Part Number: YC164-FR-0710KL; RoHS: Yes; Category: Resistor Arrays; Stock 1: 25000; Pricing 1: 5000=0.0101, 20000=0.0095, 50000=0.0092, 125000=0.0089, 200000=0.0085 (USD); Mounting Technology: Surface Mount; Pins: 8; Case Code (Metric): 3216; Case Code (Imperial): 1206; Min Operating Temperature: -55°C; Max Operating Temperature: 155°C; Packaging: Tape and Reel; Number of Resistors: 4; Number of Circuits: 4; Series: YC164; Resistance Tolerance: 1%; Length: 0.126inch; Width: 0.063inch; Height: 0.028inch; Lead Free: Lead Free; RoHS Compliant: Yes; Reach SVHC Compliant: Unknown; ComponentLink1URL: http://www.farnell.com/datasheets/2167431.pdf?src-supplier=Farnell; ComponentLink1Description: http://www.farnell.com/datasheets/2167431.pdf?src-supplier=Farnell; ComponentLink2URL: https://media.digikey.com/pdf/Data%20Sheets/Yageo%20PDFs/YC102-358,TC122-164_Series_DS.pdf?src-supplier=Digi-Key; ComponentLink2Description: https://media.digikey.com/pdf/Data%20Sheets/Yageo%20PDFs/YC102-358,TC122-164_Series_DS.pdf?src-supplier=Digi-Key; ComponentLink3URL: http://www.farnell.com/datasheets/2167431.pdf?src-supplier=Element14; ComponentLink3Description: http://www.farnell.com/datasheets/2167431.pdf?src-supplier=Element14; ComponentLink4URL: http://www.farnell.com/datasheets/443424.pdf?src-supplier=Element14; ComponentLink4Description: http://www.farnell.com/datasheets/443424.pdf?src-supplier=Element14; ComponentLink5URL: http://www.farnell.com/datasheets/2167431.pdf?src-supplier=Newark; ComponentLink5Description: http://www.farnell.com/datasheets/2167431.pdf?src-supplier=Newark; Supplier Part Number 1: 5054288; LCSC Part Number: C110924
U11 = W5500: SPI LQFP-48(7x7) Ethernet ICs ROHS; Manufacturer: WIZNET; Item Type: IC; Manufacturer Part Number: W5500; LCSC Part Number: C32843; Package: LQFP-48(7x7); ComponentLink1Description: LCSC; ComponentLink1URL: https://www.lcsc.com/product-detail/Ethernet-ICs_WIZNET-W5500_C32843.html
U12 = SP0504BAHTG: TVS DIODE 5.5VWM 8.5VC SOT23-5; Manufacturer: Littelfuse; Direction: Unidirectional; Value: 30pF; Number of Channels: 4; Polarity: Bidirectional,Unidirectional; Breakdown Voltage: 5.5V; Clamping Voltage: 7.8V; Max Power Dissipation: 225mW; Power Line Protection: No; Leakage Current: 100nA; ESD Protection: Yes; Voltage Rating (DC): 5V; Diode Type: ZENER; Clamping Voltage-Max: 8V; Supplier 1: Future Electronics; Manufacturer Part Number: SP0504BAHTG; RoHS: Yes; Category: TVS Diodes; Stock 1: 1611; Pricing 1: 1=0.78, 15=0.685, 75=0.625, 300=0.575, 1500=0.52 (USD); Mounting Technology: Surface Mount; Case/Package: SOT-23; Pins: 5; Min Operating Temperature: -40°C; Max Operating Temperature: 85°C; Packaging: Tape and Reel; Termination: SMD/SMT; Working Voltage: 5.5V; Number of Unidirectional Channels: 4; Reverse Standoff Voltage: 5.5V; Number of Elements: 4; Peak Pulse Power: 225mW; Max Reverse Leakage Current: 100nA; Power Dissipation: 225mW; Series: SP05, SPA®; Length: 3.05mm; Width: 1.75mm; Height: 1.3mm; Depth: 1.75mm; Radiation Hardening: No; Lead Free: Lead Free; RoHS Compliant: Yes; Reach SVHC Compliant: Unknown; ComponentLink1URL: https://datasheet.ciiva.com/15143/getdatasheetpartid-152299-15143806.pdf?src-supplier=Verical; ComponentLink1Description: https://datasheet.ciiva.com/15143/getdatasheetpartid-152299-15143806.pdf?src-supplier=Verical; ComponentLink2URL: https://datasheet.ciiva.com/4509/sp05x-leadfree-4509638.pdf?src-supplier=Mouser; ComponentLink2Description: https://datasheet.ciiva.com/4509/sp05x-leadfree-4509638.pdf?src-supplier=Mouser; ComponentLink3URL: https://datasheet.ciiva.com/22697/1911798-22697943.pdf?src-supplier=Element14; ComponentLink3Description: https://datasheet.ciiva.com/22697/1911798-22697943.pdf?src-supplier=Element14; ComponentLink4URL: https://datasheet.ciiva.com/8062/littefuse-spa-sp050x-8062425.pdf?src-supplier=Element14; ComponentLink4Description: https://datasheet.ciiva.com/8062/littefuse-spa-sp050x-8062425.pdf?src-supplier=Element14; ComponentLink5URL: https://datasheet.ciiva.com/332/sp05xxba-332619.pdf?src-supplier=Digi-Key; ComponentLink5Description: https://datasheet.ciiva.com/332/sp05xxba-332619.pdf?src-supplier=Digi-Key; ComponentLink6URL: https://datasheet.ciiva.com/332/sp05xxba-332620.pdf?src-supplier=Digi-Key; ComponentLink6Description: https://datasheet.ciiva.com/332/sp05xxba-332620.pdf?src-supplier=Digi-Key; ComponentLink7URL: https://datasheet.ciiva.com/16393/sp05xxba-16393404.pdf?src-supplier=Future+Electronics; ComponentLink7Description: https://datasheet.ciiva.com/16393/sp05xxba-16393404.pdf?src-supplier=Future+Electronics; ComponentLink8URL: https://datasheet.ciiva.com/332/sp05xxba-332621.pdf?src-supplier=Digi-Key; ComponentLink8Description: https://datasheet.ciiva.com/332/sp05xxba-332621.pdf?src-supplier=Digi-Key; ComponentLink9URL: https://datasheet.ciiva.com/1268/526672-1268494.pdf?src-supplier=Element14; ComponentLink9Description: https://datasheet.ciiva.com/1268/526672-1268494.pdf?src-supplier=Element14; Supplier Part Number 1: 3283009; LCSC Part Number: C10675; Item Type: TVS Diode
X4 = Q22FA12800090: CRYSTAL 25.0000MHZ 12PF SMD; Manufacturer: Seiko Epson; ComponentLink1Description: LCSC; ComponentLink1URL: https://www.lcsc.com/product-detail/Crystals_Seiko-Epson-Q22FA12800090_C255883.html; Manufacturer Part Number: Q22FA12800090; Package: SMD2016-4P; LCSC Part Number: C255883; Item Type: Crystal